# Altium schematic sheet PowerManagement.SchDoc: Power
size A3; SheetNumber: 3; SheetTotal: 10
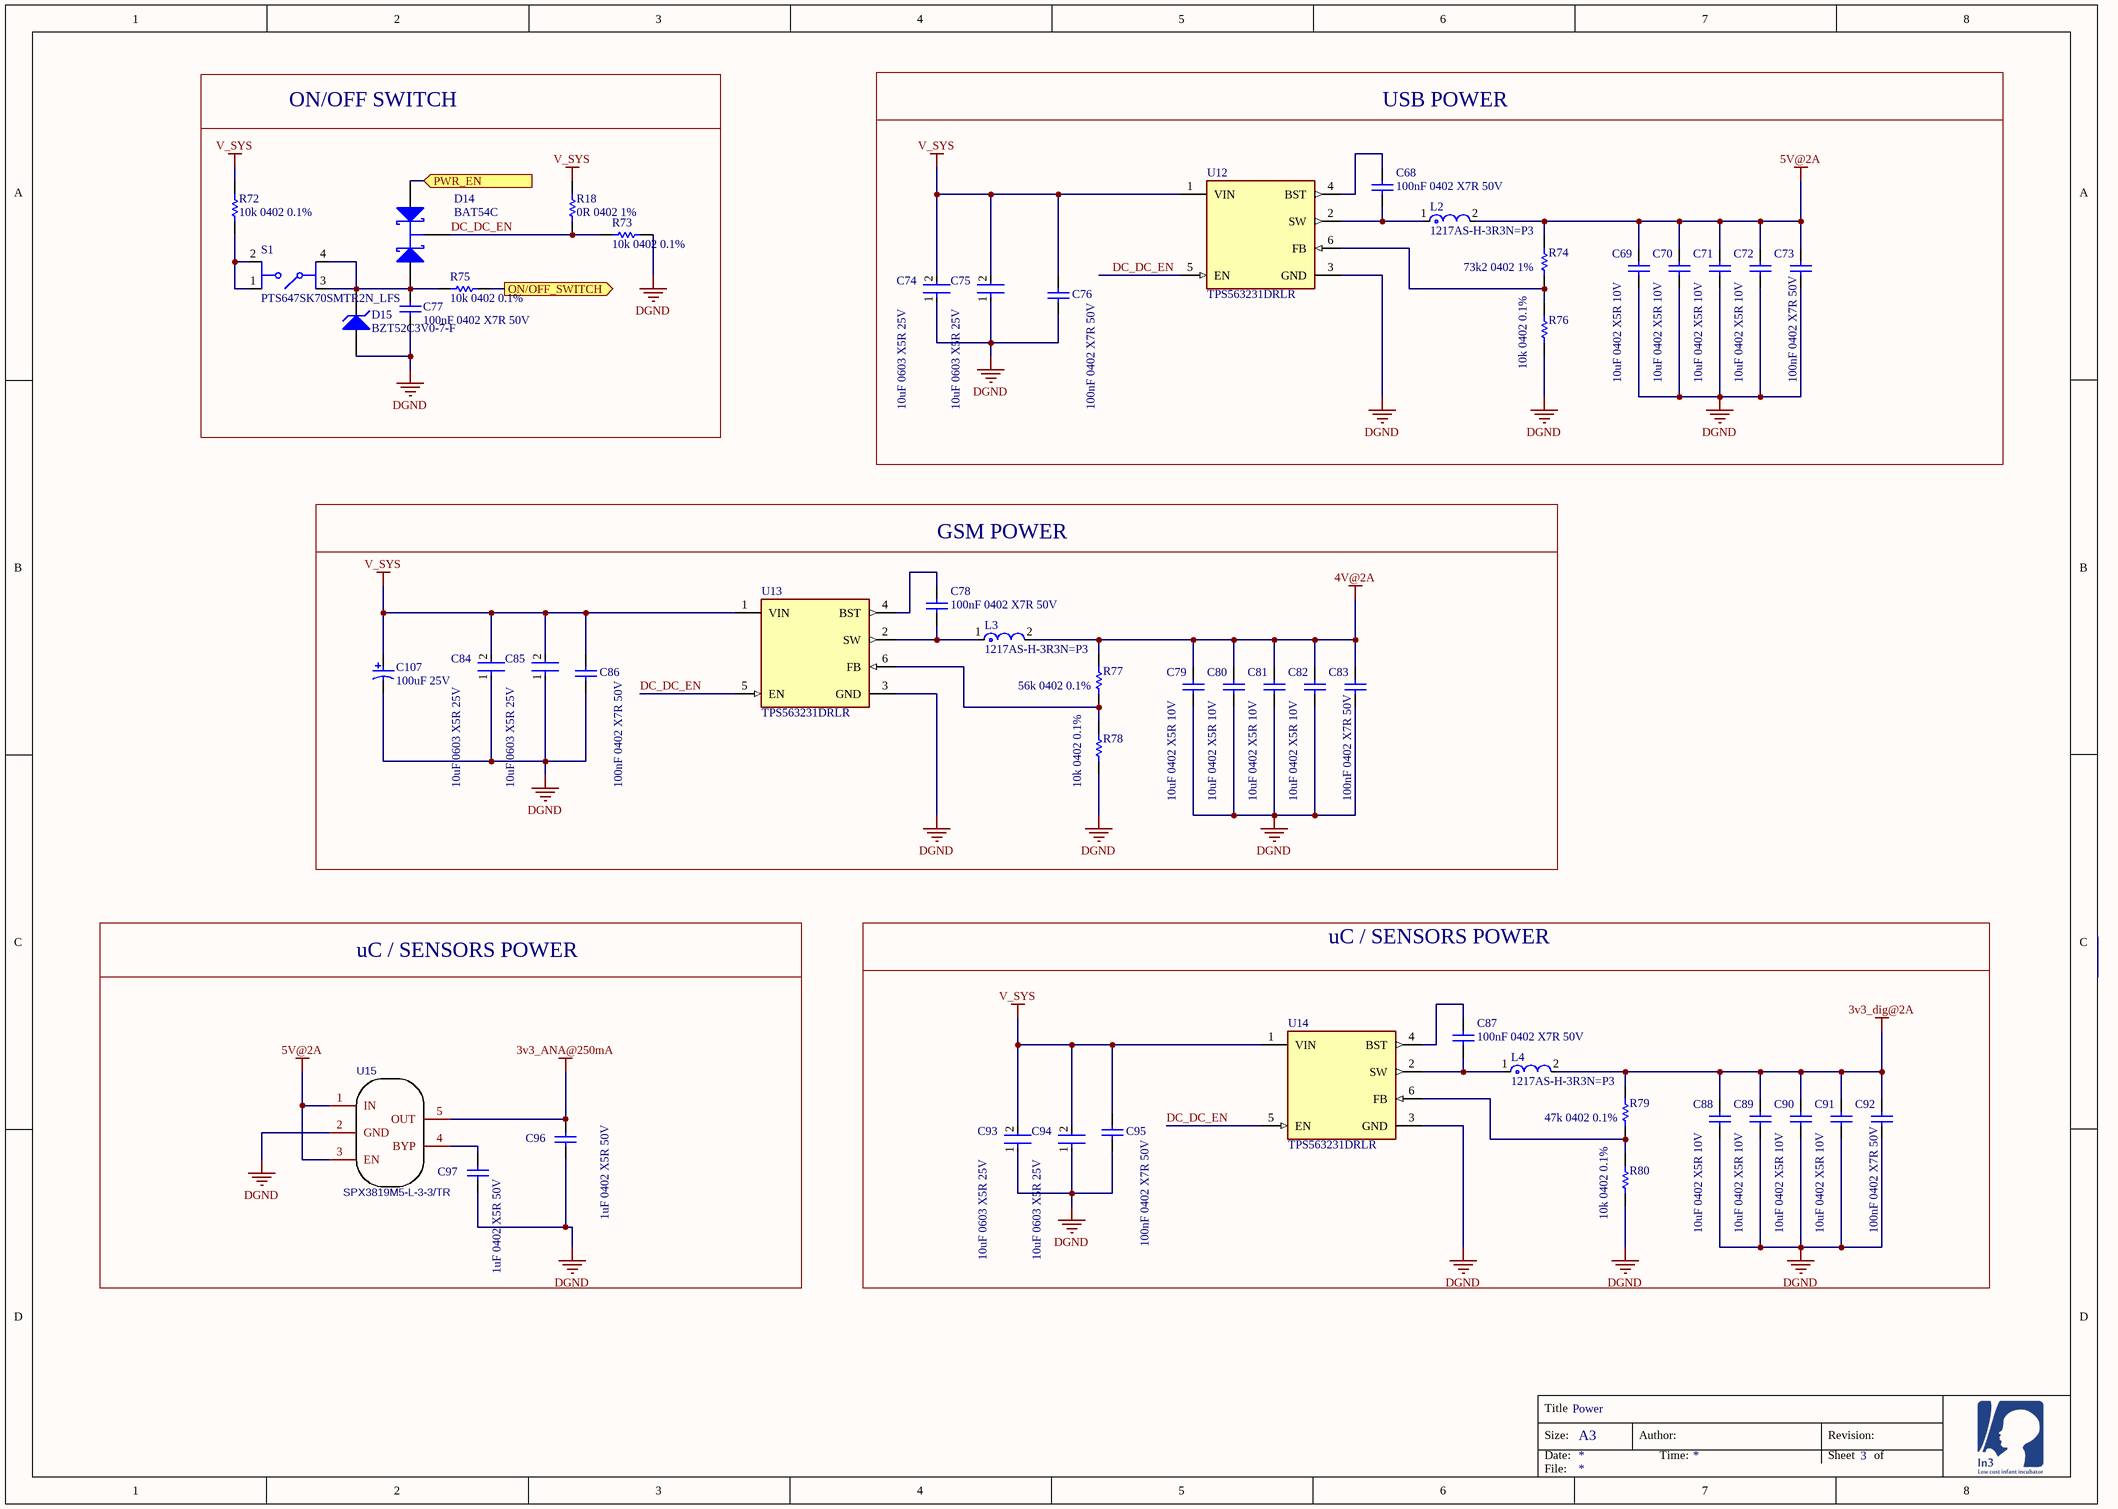
[diagram p0: PowerManagement.SchDoc]

## Parts
C68  100nF 0402 X7R 50V  [CAPC1005X55X25NL5T10]
C69  10uF 0402 X5R 10V  [CAPC1005X55X25NL5T10]
C70  10uF 0402 X5R 10V  [CAPC1005X55X25NL5T10]
C71  10uF 0402 X5R 10V  [CAPC1005X55X25NL5T10]
C72  10uF 0402 X5R 10V  [CAPC1005X55X25NL5T10]
C73  100nF 0402 X7R 50V  [CAPC1005X55X25NL5T10]
C74  10uF 0603 X5R 25V  [FP-GRM188-0_2-IPC_B]
C75  10uF 0603 X5R 25V  [FP-GRM188-0_2-IPC_B]
C76  100nF 0402 X7R 50V  [CAPC1005X55X25NL5T10]
C77  100nF 0402 X7R 50V  [CAPC1005X55X25NL5T10]
C78  100nF 0402 X7R 50V  [CAPC1005X55X25NL5T10]
C79  10uF 0402 X5R 10V  [CAPC1005X55X25NL5T10]
C80  10uF 0402 X5R 10V  [CAPC1005X55X25NL5T10]
C81  10uF 0402 X5R 10V  [CAPC1005X55X25NL5T10]
C82  10uF 0402 X5R 10V  [CAPC1005X55X25NL5T10]
C83  100nF 0402 X7R 50V  [CAPC1005X55X25NL5T10]
C84  10uF 0603 X5R 25V  [FP-GRM188-0_2-IPC_B]
C85  10uF 0603 X5R 25V  [FP-GRM188-0_2-IPC_B]
C86  100nF 0402 X7R 50V  [CAPC1005X55X25NL5T10]
C87  100nF 0402 X7R 50V  [CAPC1005X55X25NL5T10]
C88  10uF 0402 X5R 10V  [CAPC1005X55X25NL5T10]
C89  10uF 0402 X5R 10V  [CAPC1005X55X25NL5T10]
C90  10uF 0402 X5R 10V  [CAPC1005X55X25NL5T10]
C91  10uF 0402 X5R 10V  [CAPC1005X55X25NL5T10]
C92  100nF 0402 X7R 50V  [CAPC1005X55X25NL5T10]
C93  10uF 0603 X5R 25V  [FP-GRM188-0_2-IPC_B]
C94  10uF 0603 X5R 25V  [FP-GRM188-0_2-IPC_B]
C95  100nF 0402 X7R 50V  [CAPC1005X55X25NL5T10]
C96  1uF 0402 X5R 50V  [CAPC1005X55X25NL5T10]
C97  1uF 0402 X5R 50V  [CAPC1005X55X25NL5T10]
C107  100uF 25V  [CAPAE7067X55L]
D14  BAT54C  [NXP-SOT23-3_V]
D15  BZT52C3V0-7-F  [DIOD-SOD123_V]
L2  1217AS-H-3R3N=P3  [FP-DEM8045C-MFG]
L3  1217AS-H-3R3N=P3  [FP-DEM8045C-MFG]
L4  1217AS-H-3R3N=P3  [FP-DEM8045C-MFG]
R18  0R 0402 1%  [RESC1005X40X25ML05T10]
R72  10k 0402 0.1%  [RESC1005X40X25ML05T10]
R73  10k 0402 0.1%  [RESC1005X40X25ML05T10]
R74  73k2 0402 1%  [RESC1005X40X25ML05T10]
R75  10k 0402 0.1%  [RESC1005X40X25ML05T10]
R76  10k 0402 0.1%  [RESC1005X40X25ML05T10]
R77  56k 0402 0.1%  [RESC1005X40X25ML05T10]
R78  10k 0402 0.1%  [RESC1005X40X25ML05T10]
R79  47k 0402 0.1%  [RESC1005X40X25ML05T10]
R80  10k 0402 0.1%  [RESC1005X40X25ML05T10]
S1  PTS647SK70SMTR2N_LFS  [PTS647SK70SMTR2NLFS]
U12  TPS563231DRLR  [FP-DRL0006A-MFG]
U13  TPS563231DRLR  [FP-DRL0006A-MFG]
U14  TPS563231DRLR  [FP-DRL0006A-MFG]
U15  SPX3819M5-L-3-3/TR  [SOT-23-5_L3.0-W1.7-P0.95-LS2.8-BR]

## Blocks framed on the sheet
USB POWER: C68-C76 L2 R74 R76 U12
ON/OFF SWITCH: C77 D14 D15 R18 R72 R73 R75 S1
GSM POWER: C78-C86 C107 L3 R77 R78 U13
uC / SENSORS POWER: C87-C95 L4 R79 R80 U14
uC / SENSORS POWER: C96 C97 U15

## Ports
ON/OFF_SWITCH (out), PWR_EN (in)

## Nets
3v3_ANA@250mA: C96.2 U15.5(OUT)
3v3_dig@2A: C88.2 C89.2 C90.2 C91.2 C92.2 L4.2 R79.2
4V@2A: C79.2 C80.2 C81.2 C82.2 C83.2 L3.2 R77.2
5V@2A: C69.2 C70.2 C71.2 C72.2 C73.2 L2.2 R74.2 U15.1(IN) U15.3(EN)
DGND: C69.1 C70.1 C71.1 C72.1 C73.1 C74.1 C75.1 C76.1 C77.1 C79.1 C80.1 C81.1 C82.1 C83.1 C84.1 C85.1 C86.1 C88.1 C89.1 C90.1 C91.1 C92.1 C93.1 C94.1 C95.1 C96.1 C97.1 C107.2 D15.1(A) R73.1 R76.1 R78.1 R80.1 U12.3(GND) U13.3(GND) U14.3(GND) U15.2(GND)
V_SYS: C74.2 C75.2 C76.2 C84.2 C85.2 C86.2 C93.2 C94.2 C95.2 C107.1 R18.1 R72.1 U12.1(VIN) U13.1(VIN) U14.1(VIN)
DC_DC_EN: D14.3(K) R18.2 R73.2 U12.5(EN) U13.5(EN) U14.5(EN)
ON/OFF_SWITCH: R75.1 ; port ON/OFF_SWITCH
PWR_EN: D14.2(A) ; port PWR_EN
NetC68_1: C68.1 L2.1 U12.2(SW)
NetC68_2: C68.2 U12.4(BST)
NetC77_2: C77.2 D14.1(A) D15.2(K) R75.2 S1.3(COM_1) S1.4(COM_2)
NetC78_1: C78.1 L3.1 U13.2(SW)
NetC78_2: C78.2 U13.4(BST)
NetC87_1: C87.1 L4.1 U14.2(SW)
NetC87_2: C87.2 U14.4(BST)
NetC97_2: C97.2 U15.4(BYP)
NetR72_2: R72.2 S1.1(NO_1) S1.2(NO_2)
NetR74_1: R74.1 R76.2 U12.6(FB)
NetR77_1: R77.1 R78.2 U13.6(FB)
NetR79_1: R79.1 R80.2 U14.6(FB)

## Notes on the sheet
- Title
- Size:
- Date:
- A3
- Author:
- Time:
- Revision:
- Sheet
- of
- File:

## Library data of the parts
C68-C73 C76-C83 C86-C92 C95-C97 = CMP-1662-00020-1: ComponentLink2Description: Datasheet; ComponentLink2URL: http://psearch.en.murata.com/capacitor/product/GRM155R60J105KE19%23.pdf; ComponentLink1Description: Manufacturer URL; ComponentLink1URL: http://www.murata.com/
  C68 C73 C76-C78 C83 C86 C87 C92 C95: LCSC_PN: C77020
  C69-C72 C79-C82 C88-C91: LCSC_PN: C77000
  C96 C97: LCSC_PN: C1518208
C74 C75 C84 C85 C93 C94 = CMP-06035-022879-1: LCSC_PN: C91606
C107 = CMP-2000-07374-1: Aluminum Electrolytic Capacitor, 100 uF, +/- 20%, 16 V, -40 to 85 degC, 2-Pin SMD, RoHS, Tape and Reel; Manufacturer: Nichicon; Type: Can; Rated Voltage: 16V; Capacitance: 100µF; Case Size/Dimension: Ø6.3x5.4mm; Mounting Technology: SurfaceMount; Datasheet Version: 08/2015; Operating Temp-Max: 85°C; Datasheet URL: http://nichicon-us.com/english/products/pdfs/e-uwx.pdf; Package Description: 2-Pin Surface Mount Device, Body 6.6 x 6.6 mm; Package Reference: CAPAE7067X55; Manufacturer URL: http://www.nichicon.co.jp/english/; LCSC_PN: C7469933
D14 = CMP-0417-00003-1: Schottky Barrier Diode, 30 V, 2 uA, -55 to 150 degC, 3-Pin SOT23, RoHS, Tape and Reel; Manufacturer: NXP Semiconductors; IR (uA): 2; VF (mV): 800; Trr (ns): 5; Cd (pF): 10; VR (V): 30; Rth(j-a) (K/W): 500; RoHS: TRUE; Packing: Tape and Reel; ComponentLink2URL: http://www.nxp.com/documents/data_sheet/BAT54_SER.pdf; PartNumber: BAT54C; ComponentLink2Description: Datasheet; Temperature Range: -55 to 150 degC; PackageReference: SOT23-3; PackageDescription: 3-Pin Plastic Surface-mounted Package, Body 1.3 x 2.9 mm, Pitch 0.95 mm; Mounting Technology: Surface Mount; ComponentLink1URL: http://www.nxp.com/; DatasheetVersion: Rev. 5; ComponentLink1Description: Manufacturer URL; LCSC_PN: C181200
D15 = CMP-2000-05974-1: Surface Mount Zener Diode, 3 V, -65 to 150 degC, 2-Pin SOD123, RoHS, Tape and Reel; Unit Weight: 0.000353oz; Voltage Temperature Coefficient: -1.75mV/C; Zener Current: 5mA; Zz - Zener Impedance: 95Ohms; Pd - Power Dissipation: 500mW; Configuration: Single; Voltage Tolerance: 5%; Vz - Zener Voltage: 3V; Brand: DiodesIncorporated; Ir - Reverse Current: 10uA; Package Description: 2-Pin Surface Mount Device, Body 2.7 x 1.55 mm; Length: 2.85mm; Package Reference: SOD123; Width: 1.7mm; RoHS: True; Packaging: Reel; Datasheet Version: Rev. 37-2, 09/2012; Datasheet URL: http://www.diodes.com/_files/datasheets/ds18004.pdf; Maximum Operating Temperature: +150C; Product Category: ZenerDiodes; Minimum Operating Temperature: -65C; Mounting Technology: SurfaceMount; Mounting Style: SMD/SMT; Series: BZT52C; Height: 1.35mm; Factory Pack Quantity: 3000; Manufacturer URL: http://www.diodes.com/; Package / Case: SOD-123; Termination Style: SMD/SMT; Manufacturer: DiodesIncorporated; LCSC_PN: C85212
L2-L4 = CMP-06042-006799-1: Shielded Wirewound Inductor 3.3uH 30% 6800mA 0.0144Ω SMD; Saturation Current: 7.7A; Core Material: Ferrite; Current Rating: 6.8A; Test Frequency: 100kHz; DC Resistance (DCR): 14.4mR; Height - Seated (Max): 0.177inch; Packaging: Tape and Reel; Resistor Type: Wirewound; Tolerance: 30%; Inductance: 3.3uH; Length: 0.315inch; Number of Pins: 2; Case/Package: SMD/SMT; Mount: Surface Mount; Max DC Current: 6.8A; Width: 0.315inch; Shielding: Shielded; LCSC_PN: C514864
R18 R72 R73 R75-R80 = CMP-2002-07472-1
  R18: LCSC_PN: C60485
  R72 R73 R75 R76 R78 R80: LCSC_PN: C190095
  R77: LCSC_PN: C114756
  R79: LCSC_PN: C93943
R74 = CMP-2002-07472-1: Manufacturer: Yageo / Phycomp; LCSC_PN: C185398
S1 = PTS647SK70SMTR2N_LFS: Switch (4-Pin Push); Manufacturer_Name: C & K COMPONENTS; Manufacturer_Part_Number: PTS647SK70SMTR2N LFS; Datasheet Link: https://www.ckswitches.com/media/2567/pts647.pdf; Height: 7mm; LCSC_PN: C47324878
U12-U14 = CMP-04918-000435-1: POWER MANAGEMENT; LCSC_PN: C779412
U15 = SPX3819M5-L-3-3/TR: BOM_Manufacturer: EXAR; BOM_Supplier: LCSC; BOM_Manufacturer Part: SPX3819M5-L-3-3/TR; BOM_Supplier Part: C9055; BOM_JLCPCB Part Class: Extended Part; spicePre: U; spiceSymbolName: SPX3819M5-L-3-3/TR; LCSC_PN: C9055